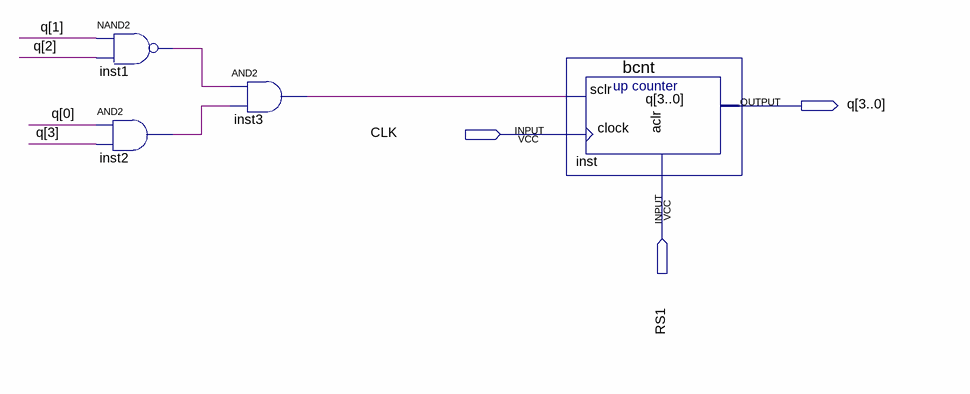
[diagram p0: schematic sheet]
// Quartus schematic bcd1cntx.bdf as structural Verilog: 4 symbols, 3 pins
module bcd1cntx (
  input  CLK,
  input  RS1,
  output [3:0] q
);

  wire inst1_out, inst2_out, inst3_out;

  nand inst1 (inst1_out, q[1], q[2]);
  and inst2 (inst2_out, q[0], q[3]);
  and inst3 (inst3_out, inst1_out, inst2_out);
  bcnt inst (.sclr(inst3_out), .clock(CLK), .aclr(RS1), .q(q));
endmodule
